# Altium schematic sheet FPGA_Configuration.SchDoc: Configuration Logic
size B; Organization: UCLA High Energy Physics; DocumentNumber: 12; Revision: 2.0; SheetNumber: 12; SheetTotal: 23; CurrentDate: 9/6/2018; ModifiedDate: 9/6/2018
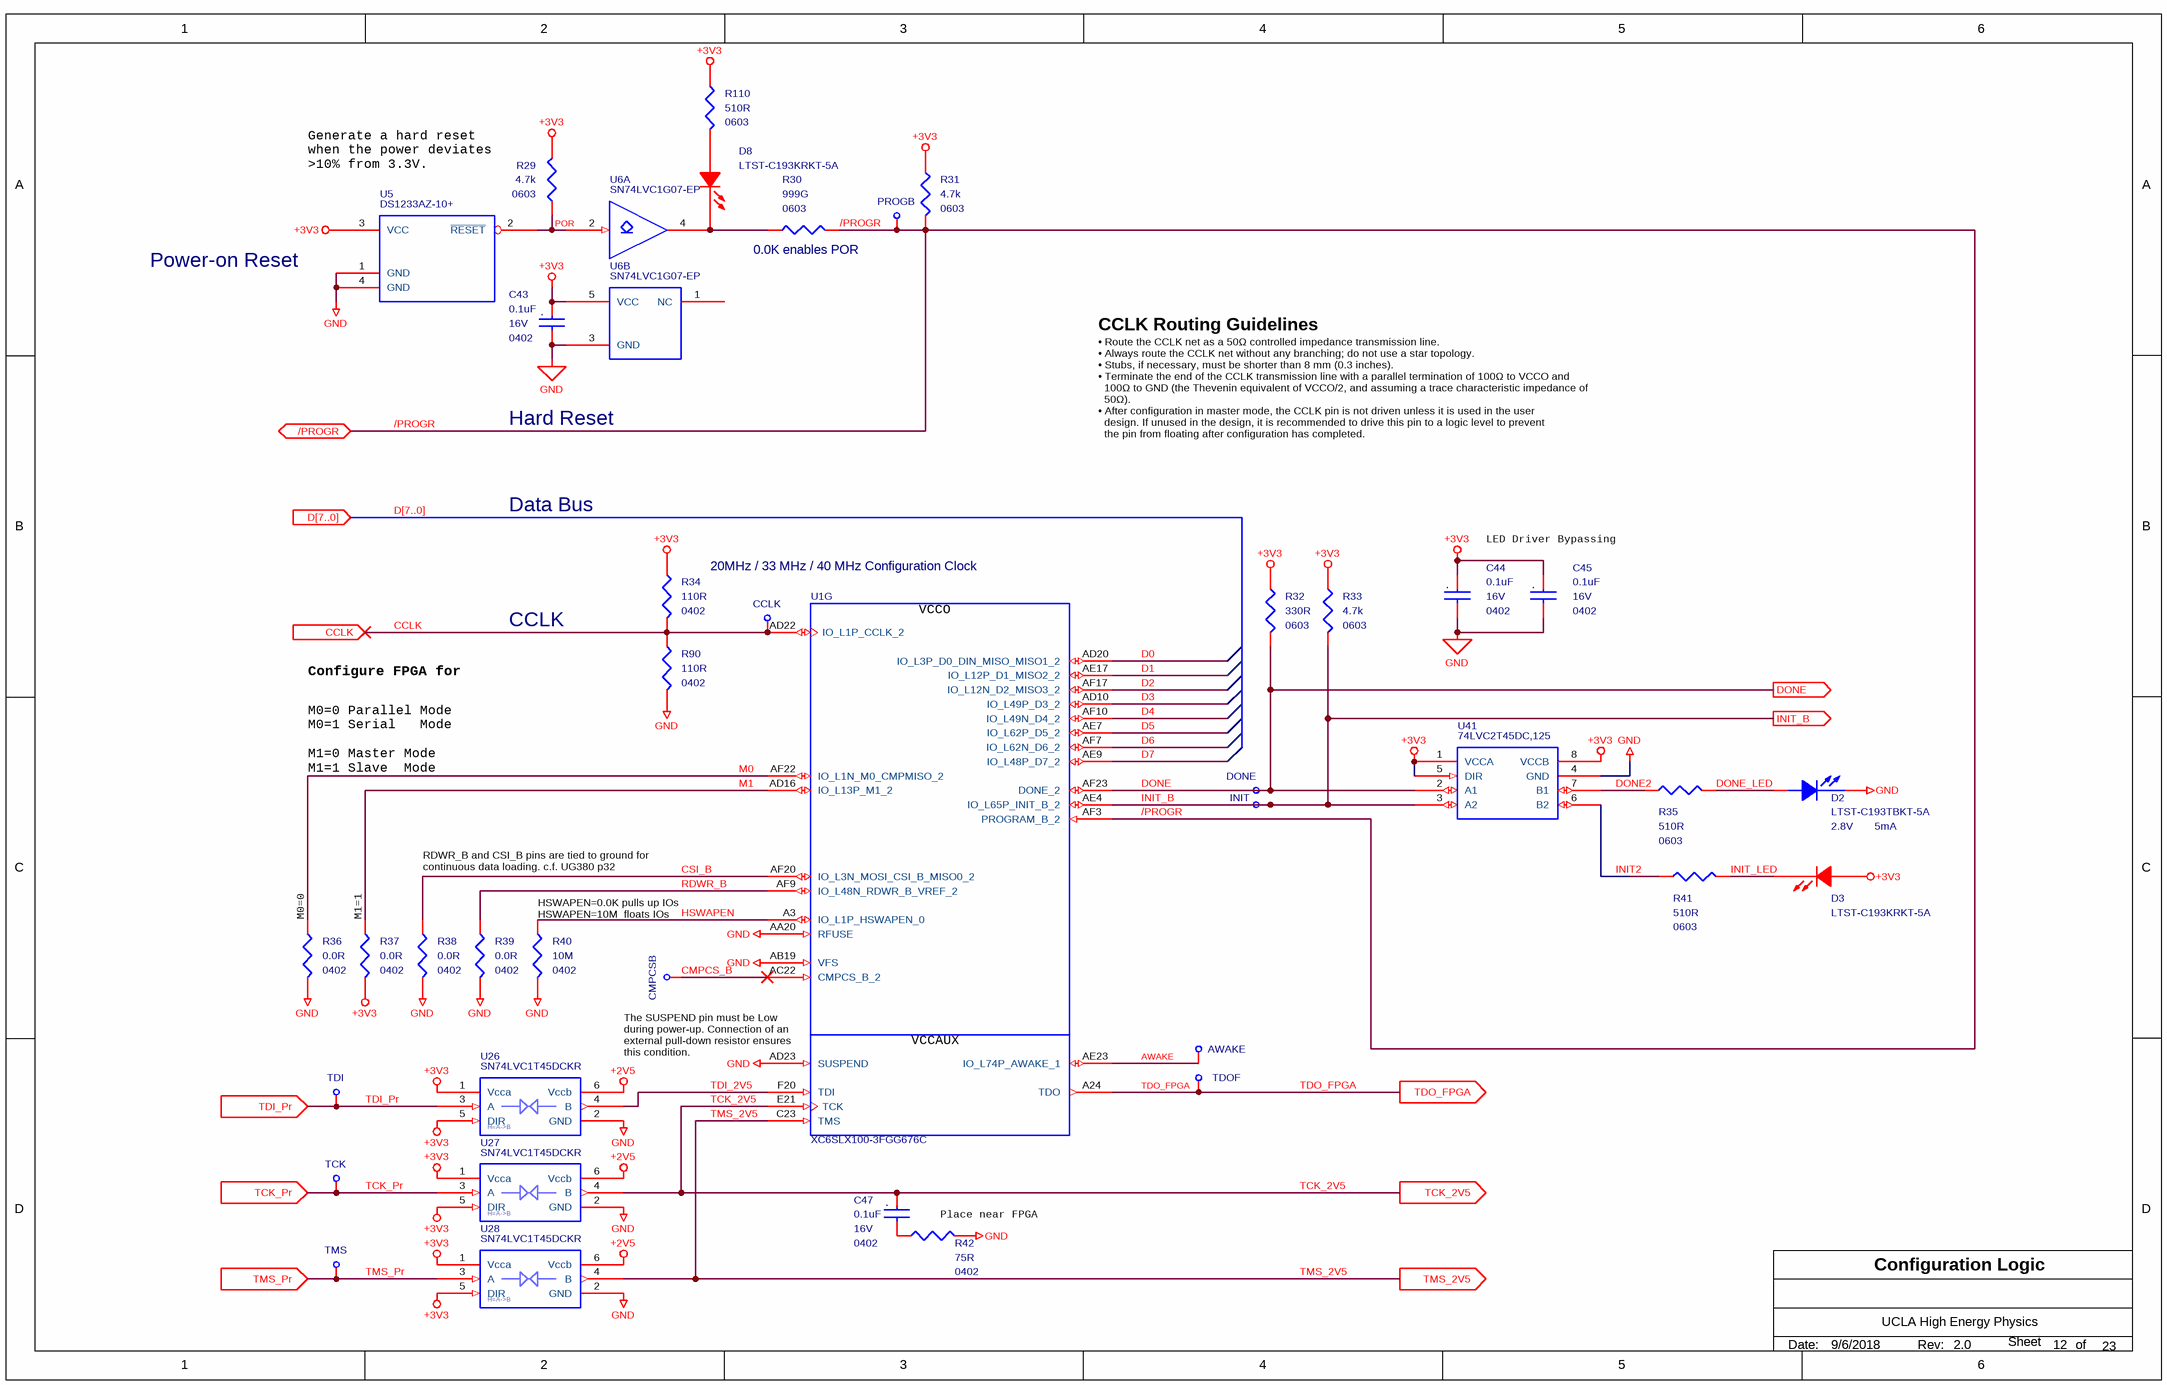
[diagram p0: FPGA_Configuration.SchDoc]

## Parts
AWAKE  Test Point Via  [MC_S6/TH/TPVIA]  (value not drawn)  (no BOM)
C43  0.1uF  package: 0402  Voltage - Rated: 16V  [MC_S6/SM/C_0402_IPC]
C44  0.1uF  package: 0402  Voltage - Rated: 16V  [MC_S6/SM/C_0402_IPC]
C45  0.1uF  package: 0402  Voltage - Rated: 16V  [MC_S6/SM/C_0402_IPC]
C47  0.1uF  package: 0402  Voltage - Rated: 16V  [MC_S6/SM/C_0402_IPC]
CCLK  Test Point Via  [MC_S6/TH/TPVIA]  (value not drawn)  (no BOM)
CMPCSB  Test Point Via  [MC_S6/TH/TPVIA]  (value not drawn)  (no BOM)
D2  LTST-C193TBKT-5A  Voltage - Forward (Vf) (Typ): 2.8V  Current - Test: 5mA  [MC_S6/SM/LED_0603]
D3  LTST-C193KRKT-5A  [MC_S6/SM/LED_0603]
D8  LTST-C193KRKT-5A  [MC_S6/SM/LED_0603]
DONE  Test Point Via  [MC_S6/TH/TPVIA]  (value not drawn)  (no BOM)
INIT  Test Point Via  [MC_S6/TH/TPVIA]  (value not drawn)  (no BOM)
PROGB  Test Point Via  [MC_S6/TH/TPVIA]  (value not drawn)  (no BOM)
R29  4.7k  Supplier Device Package: 0603  [MC_S6/SM/R_0603_IPC]
R30  999G  Supplier Device Package: 0603  [MC_S6/SM/R_0603_IPC]  (no BOM)
R31  4.7k  Supplier Device Package: 0603  [MC_S6/SM/R_0603_IPC]
R32  330R  Supplier Device Package: 0603  [MC_S6/SM/R_0603_IPC]
R33  4.7k  Supplier Device Package: 0603  [MC_S6/SM/R_0603_IPC]
R34  110R  Supplier Device Package: 0402  [MC_S6/SM/R_0402_IPC]
R35  510R  Supplier Device Package: 0603  [MC_S6/SM/R_0603_IPC]
R36  0.0R  Supplier Device Package: 0402  [MC_S6/SM/R_0402_IPC]
R37  0.0R  Supplier Device Package: 0402  [MC_S6/SM/R_0402_IPC]
R38  0.0R  Supplier Device Package: 0402  [MC_S6/SM/R_0402_IPC]
R39  0.0R  Supplier Device Package: 0402  [MC_S6/SM/R_0402_IPC]
R40  10M  Supplier Device Package: 0402  [MC_S6/SM/R_0402_IPC]
R41  510R  Supplier Device Package: 0603  [MC_S6/SM/R_0603_IPC]
R42  75R  Supplier Device Package: 0402  [MC_S6/SM/R_0402_IPC]
R90  110R  Supplier Device Package: 0402  [MC_S6/SM/R_0402_IPC]
R110  510R  Supplier Device Package: 0603  [MC_S6/SM/R_0603_IPC]
TCK  Test Point Via  [MC_S6/TH/TPVIA]  (value not drawn)  (no BOM)
TDI  Test Point Via  [MC_S6/TH/TPVIA]  (value not drawn)  (no BOM)
TDOF  Test Point Via  [MC_S6/TH/TPVIA]  (value not drawn)  (no BOM)
TMS  Test Point Via  [MC_S6/TH/TPVIA]  (value not drawn)  (no BOM)
U1  XC6SLX100-3FGG676C  [FGG676]  (part G of 10)
U5  DS1233AZ-10+  [MC_S6/SM/SOT223_1243]
U6  SN74LVC1G07-EP  [SOT353-1]  (parts A,B of 2)
U26  SN74LVC1T45DCKR  [MC_S6/SM/SOT_SC70_DCK6]
U27  SN74LVC1T45DCKR  [MC_S6/SM/SOT_SC70_DCK6]
U28  SN74LVC1T45DCKR  [MC_S6/SM/SOT_SC70_DCK6]
U41  74LVC2T45DC,125  [VSSOP8 SOT765-1]

## Ports
/PROGR (bidir), CCLK (in), D[7..0] (in), DONE (out), INIT_B (out), TCK_2V5 (out), TCK_Pr (in), TDI_Pr (in), TDO_FPGA (out), TMS_2V5 (out), TMS_Pr (in)

## Nets
+2V5: U26.6(Vccb) U27.6(Vccb) U28.6(Vccb)
+3V3: C43.1 C44.1 C45.1 D3.A(ANODE) R29.1 R31.1 R32.1 R33.1 R34.1 R37.2 R110.1 U5.3(VCC) U6.5(VCC) U26.1(Vcca) U26.5(DIR) U27.1(Vcca) U27.5(DIR) U28.1(Vcca) U28.5(DIR) U41.1(VCCA) U41.5(DIR) U41.8(VCCB)
GND: C43.2 C44.2 C45.2 D2.K(CATHODE) R36.2 R38.2 R39.2 R40.2 R42.2 R90.2 U1.AA20(RFUSE) U1.AB19(VFS) U1.AD23(SUSPEND) U5.1(GND) U5.4(GND) U6.3(GND) U26.2(GND) U27.2(GND) U28.2(GND) U41.4(GND)
/PROGR: PROGB.1(In) R30.2 R31.2 U1.AF3(PROGRAM_B_2) ; port /PROGR
AWAKE: AWAKE.1(In) U1.AE23(IO_L74P_AWAKE_1)
CCLK: CCLK.1(In) R34.2 R90.1 U1.AD22(IO_L1P_CCLK_2) ; port CCLK
CMPCS_B: CMPCSB.1(In) U1.AC22(CMPCS_B_2)
CSI_B: R38.1 U1.AF20(IO_L3N_MOSI_CSI_B_MISO0_2)
D0: U1.AD20(IO_L3P_D0_DIN_MISO_MISO1_2)
D1: U1.AE17(IO_L12P_D1_MISO2_2)
D2: U1.AF17(IO_L12N_D2_MISO3_2)
D3: U1.AD10(IO_L49P_D3_2)
D4: U1.AF10(IO_L49N_D4_2)
D5: U1.AE7(IO_L62P_D5_2)
D6: U1.AF7(IO_L62N_D6_2)
D7: U1.AE9(IO_L48P_D7_2)
DONE: DONE.1(In) R32.2 U1.AF23(DONE_2) U41.2(A1) ; port DONE
DONE2: R35.1 U41.7(B1)
DONE_LED: D2.A(ANODE) R35.2
HSWAPEN: R40.1 U1.A3(IO_L1P_HSWAPEN_0)
INIT2: R41.1 U41.6(B2)
INIT_B: INIT.1(In) R33.2 U1.AE4(IO_L65P_INIT_B_2) U41.3(A2) ; port INIT_B
INIT_LED: D3.K(CATHODE) R41.2
M0: R36.1 U1.AF22(IO_L1N_M0_CMPMISO_2)
M1: R37.1 U1.AD16(IO_L13P_M1_2)
POR: R29.2 U5.2(~{RESET}) U6.2(A)
RDWR_B: R39.1 U1.AF9(IO_L48N_RDWR_B_VREF_2)
TCK_2V5: C47.1 U1.E21(TCK) U27.4(B) ; port TCK_2V5
TCK_Pr: TCK.1(In) U27.3(A) ; port TCK_Pr
TDI_2V5: U1.F20(TDI) U26.4(B)
TDI_Pr: TDI.1(In) U26.3(A) ; port TDI_Pr
TDO_FPGA: TDOF.1(In) U1.A24(TDO) ; port TDO_FPGA
TMS_2V5: U1.C23(TMS) U28.4(B) ; port TMS_2V5
TMS_Pr: TMS.1(In) U28.3(A) ; port TMS_Pr
NetC47_2: C47.2 R42.1
NetD8_A: D8.A(ANODE) R110.2
NetD8_K: D8.K(CATHODE) R30.1 U6.4(Y)

Not connected (* = marked no-connect by the designer): U6 1(NC)

## Buses and harness runs
bus D[7..0] = port D[7..0]

## Notes on the sheet
- Generate a hard reset when the power deviates >10% from 3.3V.
- (near R30) 0.0K enables POR
- Power-on Reset
- CCLK Routing Guidelines
- Hard Reset
- • Route the CCLK net as a 50Ω controlled impedance transmission line.
  • Always route the CCLK net without any branching; do not use a star topology.
  • Stubs, if necessary, must be shorter than 8 mm (0.3 inches).
  • Terminate the end of the CCLK transmission line with a parallel termination of 100Ω to VCCO and
  100Ω to GND (the Thevenin equivalent of VCCO/2, and assuming a trace characteristic impedance of
  50Ω).
  • After configuration in master mode, the CCLK pin is not driven unless it is used in the user
  design. If unused in the design, it is recommended to drive this pin to a logic level to prevent
  the pin from floating after configuration has completed.
- Data Bus
- LED Driver Bypassing
- 20MHz / 33 MHz / 40 MHz Configuration Clock
- Configure FPGA for Parallel Slave SelectMap
- CCLK
- M0=0 Parallel Mode
  M0=1 Serial   Mode
  M1=0 Master Mode
  M1=1 Slave  Mode
- RDWR_B and CSI_B pins are tied to ground for continuous data loading. c.f. UG380 p32
- (near R36) M0=0
- (near R37) M1=1
- (near R40) HSWAPEN=0.0K pulls up IOs
  HSWAPEN=10M  floats IOs
- (near U1) The SUSPEND pin must be Low during power-up. Connection of an external pull-down resistor ensures this condition.
- (near R42) Place near FPGA
- Date:
- Rev:
- of
- Sheet
- (in symbol C0402C104K4RACTU) .
- (in symbol SN74LVC1T45-EP-ALCT_1) H=A->B
- (in symbol XC6SLX100-3FGG676C, part G) VCCO

## Library data of the parts
AWAKE CCLK CMPCSB DONE INIT PROGB TCK TDI TDOF TMS = TPVIA: COMPSIDE: TOP; COMPGROUP: 0; mfgr: Layout; COMPROT: 0; Package: 90; mfgr_id: TPVIA; mfgr_foot: TPVIA
C43-C45 C47 = C0402C104K4RACTU: CAP CER 0.1UF 16V X7R 0402; Manufacturer: KEMET; Capacitance: 0.10µF; Tolerance: ±10%; Supplier 1: Digi-Key; Manufacturer Part Number: C0402C104K4RACTU; RoHS: RoHS Compliant; Category: Capacitors; Stock 1: 3565698; Pricing 1: 1=0.11, 10=0.078, 25=0.0568, 50=0.0442, 100=0.0365, 250=0.03024, 500=0.02562, 1000=0.02121, 5000=0.01806 (USD); Packaging: Cut Tape (CT); Part Status: Active; Operating Temperature: -55°C ~ 125°C; Features: -; Ratings: -; Applications: General Purpose; Failure Rate: -; Mounting Type: Surface Mount, MLCC; Package / Case: 0402 (1005 Metric); Size / Dimension: 0.039" L x 0.020" W (1.00mm x 0.50mm); Height - Seated (Max): -; Thickness (Max): 0.022" (0.55mm); Lead Spacing: -; Lead Style: -; ComponentLink1URL: http://www.kemet.com/docfinder?Partnumber=C0402C104K4RACTU; ComponentLink1Description: http://www.kemet.com/docfinder?Partnumber=C0402C104K4RACTU; Supplier 2: Digi-Key; Stock 2: 3565998; Pricing 2: 1=0.11, 10=0.078, 25=0.0568, 50=0.0442, 100=0.0365, 250=0.03024, 500=0.02562, 1000=0.02121, 5000=0.01806 (USD); Supplier Part Number 1: 399-3521-1-ND; Supplier Part Number 2: 399-3521-6-ND; Temperature Coefficient: X7R
D2 = LTST-C193TBKT-5A: LED BLUE CLEAR 0603 SMD; Manufacturer: Lite-On Inc.; Lens Color: Colorless; Millicandela Rating: 15mcd; Lens Style/Size: Rectangle with Flat Top, 1.15mm x 0.80mm; Viewing Angle: 130°; Wavelength - Dominant: 470nm; Wavelength - Peak: 468nm; Supplier 1: Digi-Key; Manufacturer Part Number: LTST-C193TBKT-5A; RoHS: RoHS Compliant; Category: Optoelectronics; Stock 1: 380419; Pricing 1: 1=0.47, 10=0.336, 25=0.2572, 100=0.1678, 250=0.12304, 500=0.10442, 1000=0.08577 (USD); Packaging: Cut Tape (CT); Part Status: Active; Color: Blue; Lens Transparency: Clear; Mounting Type: Surface Mount; Features: -; Package / Case: 0603 (1608 Metric); Size / Dimension: 1.60mm L x 0.80mm W; Height (Max): 0.35mm; ComponentLink1URL: http://optoelectronics.liteon.com/upload/download/DS22-2004-060/P_100_LTST-C193TBKT-5A.pdf; ComponentLink1Description: http://optoelectronics.liteon.com/upload/download/DS22-2004-060/P_100_LTST-C193TBKT-5A.pdf; Supplier 2: Digi-Key; Stock 2: 380419; Pricing 2: 1=0.47, 10=0.336, 25=0.2572, 100=0.1678, 250=0.12304, 500=0.10442, 1000=0.08577 (USD); Supplier Part Number 1: 160-1827-1-ND; Supplier Part Number 2: 160-1827-6-ND; ComponentLink2Description: http://media.digikey.com/pdf/Data%20Sheets/Lite-On%20PDFs/LTST-C193TBKT-5A.pdf; ComponentLink2URL: http://media.digikey.com/pdf/Data%20Sheets/Lite-On%20PDFs/LTST-C193TBKT-5A.pdf; Supplier Device Package: Chip LED
D3 = LTST-C193KRKT-5A: LED RED CLEAR 0603 SMD; Manufacturer: Lite-On Inc.; Current - Test: 5mA; Lens Color: Colorless; Lens Style/Size: Rectangle with Flat Top, 1.15mm x 0.80mm; Millicandela Rating: 26.05mcd; Viewing Angle: 130°; Voltage - Forward (Vf) (Typ): 2V; Wavelength - Dominant: 631nm; Wavelength - Peak: 639nm; Category: Optoelectronics; Color: Red; ComponentLink1Description: http://optoelectronics.liteon.com/upload/download/DS22-2005-077/LTST-C193KRKT-5A.PDF; ComponentLink1URL: http://optoelectronics.liteon.com/upload/download/DS22-2005-077/LTST-C193KRKT-5A.PDF; Features: -; Height (Max): 0.45mm; Lens Transparency: Clear; Manufacturer Part Number: LTST-C193KRKT-5A; Mounting Type: Surface Mount; Package / Case: 0603 (1608 Metric); Packaging: Cut Tape (CT); Part Status: Active; Pricing 1: 1=0.41, 10=0.296, 25=0.2268, 100=0.148, 250=0.10852, 500=0.0921, 1000=0.07565, 2500=0.06578 (USD); Pricing 2: 1=0.41, 10=0.296, 25=0.2268, 100=0.148, 250=0.10852, 500=0.0921, 1000=0.07565, 2500=0.06578 (USD); RoHS: RoHS Compliant; Size / Dimension: 1.60mm L x 0.80mm W; Stock 1: 97257; Stock 2: 97257; Supplier 1: Digi-Key; Supplier 2: Digi-Key; Supplier Device Package: Chip LED; Supplier Part Number 1: 160-1830-1-ND; Supplier Part Number 2: 160-1830-6-ND
D8 = LTST-C193KRKT-5A: LED RED CLEAR 0603 SMD; Manufacturer: Lite-On Inc.; Lens Color: Colorless; Millicandela Rating: 26.05mcd; Lens Style/Size: Rectangle with Flat Top, 1.15mm x 0.80mm; Voltage - Forward (Vf) (Typ): 2V; Current - Test: 5mA; Viewing Angle: 130°; Wavelength - Dominant: 631nm; Wavelength - Peak: 639nm; Supplier 1: Digi-Key; Manufacturer Part Number: LTST-C193KRKT-5A; RoHS: RoHS Compliant; Category: Optoelectronics; Stock 1: 97257; Pricing 1: 1=0.41, 10=0.296, 25=0.2268, 100=0.148, 250=0.10852, 500=0.0921, 1000=0.07565, 2500=0.06578 (USD); Packaging: Cut Tape (CT); Part Status: Active; Color: Red; Lens Transparency: Clear; Mounting Type: Surface Mount; Features: -; Package / Case: 0603 (1608 Metric); Supplier Device Package: Chip LED; Size / Dimension: 1.60mm L x 0.80mm W; Height (Max): 0.45mm; ComponentLink1URL: http://optoelectronics.liteon.com/upload/download/DS22-2005-077/LTST-C193KRKT-5A.PDF; ComponentLink1Description: http://optoelectronics.liteon.com/upload/download/DS22-2005-077/LTST-C193KRKT-5A.PDF; Supplier 2: Digi-Key; Stock 2: 97257; Pricing 2: 1=0.41, 10=0.296, 25=0.2268, 100=0.148, 250=0.10852, 500=0.0921, 1000=0.07565, 2500=0.06578 (USD); Supplier Part Number 1: 160-1830-1-ND; Supplier Part Number 2: 160-1830-6-ND
R29 R31 R33 = CR0603-FX-4701ELF: RES SMD 4.7K OHM 1% 1/10W 0603; Manufacturer: Bourns Inc.; Power (Watts): 0.1W, 1/10W; Temperature Coefficient: ±100ppm/°C; Supplier 1: Digi-Key; Manufacturer Part Number: CR0603-FX-4701ELF; RoHS: RoHS Compliant; Category: Resistors; Stock 1: 43560; Pricing 1: 1=0.1, 10=0.021, 100=0.0086, 1000=0.00385, 2500=0.00334 (USD); Packaging: Cut Tape (CT); Part Status: Active; Resistance (Ohms): 4.7k; Composition: Thick Film; Features: Moisture Resistant; Operating Temperature: -55°C ~ 155°C; Package / Case: 0603 (1608 Metric); Size / Dimension: 0.063" L x 0.031" W (1.60mm x 0.80mm); Height - Seated (Max): 0.022" (0.55mm); Failure Rate: -; ComponentLink1URL: http://www.bourns.com/docs/Product-Datasheets/CHPREZTR.pdf; ComponentLink1Description: http://www.bourns.com/docs/Product-Datasheets/CHPREZTR.pdf; Supplier 2: Digi-Key; Stock 2: 43560; Pricing 2: 1=0.1, 10=0.021, 100=0.0086, 1000=0.00385, 2500=0.00334 (USD); Supplier Part Number 1: CR0603-FX-4701ELFCT-ND; Supplier Part Number 2: CR0603-FX-4701ELFDKR-ND; Tolerance: ±1%
R30 = RES999G 0603: RES SMD 999G OHM 5% 1/10W 0603; Manufacturer Part Number: Do Not Place
R32 = CR0603-FX-3300ELF: RES SMD 330 OHM 1% 1/10W 0603; Manufacturer: Bourns Inc.; Resistance (Ohms): 330; Power (Watts): 0.1W, 1/10W; Temperature Coefficient: ±100ppm/°C; Tolerance: ±1%; Supplier 1: Digi-Key; Manufacturer Part Number: CR0603-FX-3300ELF; RoHS: RoHS Compliant; Category: Resistors; Stock 1: 45245; Pricing 1: 1=0.1, 10=0.023, 100=0.0092, 1000=0.00414, 2500=0.00359 (USD); Packaging: Cut Tape (CT); Part Status: Active; Composition: Thick Film; Features: Moisture Resistant; Operating Temperature: -55°C ~ 155°C; Package / Case: 0603 (1608 Metric); Size / Dimension: 0.063" L x 0.031" W (1.60mm x 0.80mm); Height - Seated (Max): 0.022" (0.55mm); Failure Rate: -; ComponentLink1URL: http://www.bourns.com/docs/Product-Datasheets/CHPREZTR.pdf; ComponentLink1Description: http://www.bourns.com/docs/Product-Datasheets/CHPREZTR.pdf; Supplier 2: Digi-Key; Stock 2: 45245; Pricing 2: 1=0.1, 10=0.023, 100=0.0092, 1000=0.00414, 2500=0.00359 (USD); Supplier Part Number 1: CR0603-FX-3300ELFCT-ND; Supplier Part Number 2: CR0603-FX-3300ELFDKR-ND
R34 R90 = ERJ-2RKF1100X: RES SMD 110 OHM 1% 1/10W 0402; Manufacturer: Panasonic Electronic Components; Power (Watts): 0.1W, 1/10W; Temperature Coefficient: ±100ppm/°C; Supplier 1: Digi-Key; Manufacturer Part Number: ERJ-2RKF1100X; RoHS: RoHS Compliant; Category: Resistors; Stock 1: 171366; Pricing 1: 1=0.1, 10=0.039, 100=0.016, 1000=0.00719, 2500=0.00624, 5000=0.00515 (USD); Packaging: Cut Tape (CT); Part Status: Active; Composition: Thick Film; Features: Automotive AEC-Q200; Operating Temperature: -55°C ~ 155°C; Package / Case: 0402 (1005 Metric); Size / Dimension: 0.039" L x 0.020" W (1.00mm x 0.50mm); Height - Seated (Max): 0.016" (0.40mm); Failure Rate: -; ComponentLink1URL: https://industrial.panasonic.com/cdbs/www-data/pdf/RDA0000/AOA0000C304.pdf; ComponentLink1Description: https://industrial.panasonic.com/cdbs/www-data/pdf/RDA0000/AOA0000C304.pdf; Supplier 2: Digi-Key; Stock 2: 171366; Pricing 2: 1=0.1, 10=0.039, 100=0.016, 1000=0.00719, 2500=0.00624, 5000=0.00515 (USD); Supplier Part Number 1: P110LCT-ND; Supplier Part Number 2: P110LDKR-ND; Tolerance: ±1%
R35 R41 R110 = CR0603-FX-5100ELF: RES SMD 510 OHM 1% 1/10W 0603; Manufacturer: Bourns Inc.; Power (Watts): 0.1W, 1/10W; Temperature Coefficient: ±100ppm/°C; Tolerance: ±1%; Supplier 1: Digi-Key; Manufacturer Part Number: CR0603-FX-5100ELF; RoHS: RoHS Compliant; Category: Resistors; Stock 1: 523; Pricing 1: 1=0.1, 10=0.021, 100=0.0086, 1000=0.00385, 2500=0.00334 (USD); Packaging: Digi-Reel®; Part Status: Active; Composition: Thick Film; Features: Moisture Resistant; Operating Temperature: -55°C ~ 155°C; Package / Case: 0603 (1608 Metric); Size / Dimension: 0.063" L x 0.032" W (1.60mm x 0.80mm); Height - Seated (Max): 0.022" (0.55mm); Failure Rate: -; ComponentLink1URL: https://www.bourns.com/docs/Product-Datasheets/CHPREZTR.pdf; ComponentLink1Description: https://www.bourns.com/docs/Product-Datasheets/CHPREZTR.pdf; Supplier Part Number 1: CR0603-FX-5100ELFDKR-ND
R36-R39 = ERJ-2GE0R00X: RES SMD 0.0OHM JUMPER 1/10W 0402; Manufacturer: Panasonic Electronic Components; Resistance (Ohms): 0.0; Power (Watts): 0.1W, 1/10W; Tolerance: Jumper; Supplier 1: Digi-Key; Manufacturer Part Number: ERJ-2GE0R00X; RoHS: RoHS Compliant; Category: Resistors; Stock 1: 3132025; Pricing 1: 1=0.1, 50=0.0138, 100=0.0105, 250=0.0078, 500=0.00576, 1000=0.00384, 5000=0.0027 (USD); Packaging: Cut Tape (CT); Part Status: Active; Composition: Thick Film; Features: Automotive AEC-Q200; Temperature Coefficient: -; Operating Temperature: -55°C ~ 155°C; Package / Case: 0402 (1005 Metric); Size / Dimension: 0.039" L x 0.020" W (1.00mm x 0.50mm); Height - Seated (Max): 0.016" (0.40mm); Failure Rate: -; ComponentLink1URL: http://industrial.panasonic.com/www-cgi/jvcr13pz.cgi?E+PZ+3+AOA0001+ERJ2GE0R00X+7+WW; ComponentLink1Description: http://industrial.panasonic.com/www-cgi/jvcr13pz.cgi?E+PZ+3+AOA0001+ERJ2GE0R00X+7+WW; Supplier 2: Digi-Key; Stock 2: 3132025; Pricing 2: 1=0.1, 50=0.0138, 100=0.0105, 250=0.0078, 500=0.00576, 1000=0.00384, 5000=0.0027 (USD); Supplier Part Number 1: P0.0JCT-ND; Supplier Part Number 2: P0.0JDKR-ND; Number of Terminations: 2
R40 = ERJ-2GEJ106X: RES SMD 10M OHM 5% 1/10W 0402; Manufacturer: Panasonic Electronic Components; Power (Watts): 0.1W, 1/10W; Temperature Coefficient: -400/ +150ppm/°C; Tolerance: ±5%; Supplier 1: Digi-Key; Manufacturer Part Number: ERJ-2GEJ106X; RoHS: RoHS Compliant; Category: Resistors; Stock 1: 53777; Pricing 1: 1=0.1, 50=0.0106, 100=0.0078, 250=0.00596, 500=0.00476, 1000=0.0035, 5000=0.00251 (USD); Packaging: Cut Tape (CT); Part Status: Active; Resistance (Ohms): 10M; Composition: Thick Film; Features: Automotive AEC-Q200; Operating Temperature: -55°C ~ 155°C; Package / Case: 0402 (1005 Metric); Size / Dimension: 0.039" L x 0.020" W (1.00mm x 0.50mm); Height - Seated (Max): 0.016" (0.40mm); Number of Terminations: 2; Failure Rate: -; ComponentLink1URL: http://industrial.panasonic.com/www-cgi/jvcr13pz.cgi?E+PZ+3+AOA0001+ERJ2GEJ106X+7+WW; ComponentLink1Description: http://industrial.panasonic.com/www-cgi/jvcr13pz.cgi?E+PZ+3+AOA0001+ERJ2GEJ106X+7+WW; Supplier 2: Digi-Key; Stock 2: 53777; Pricing 2: 1=0.1, 50=0.0106, 100=0.0078, 250=0.00596, 500=0.00476, 1000=0.0035, 5000=0.00251 (USD); Supplier Part Number 1: P10MJCT-ND; Supplier Part Number 2: P10MJDKR-ND
R42 = ERJ-2GEJ750X: RES SMD 75 OHM 5% 1/10W 0402; Manufacturer: Panasonic Electronic Components; Power (Watts): 0.1W, 1/10W; Temperature Coefficient: ±200ppm/°C; Tolerance: ±5%; Supplier 1: Digi-Key; Manufacturer Part Number: ERJ-2GEJ750X; RoHS: RoHS Compliant; Category: Resistors; Stock 1: 127750; Pricing 1: 1=0.1, 10=0.02, 100=0.008, 1000=0.00359, 2500=0.00312, 5000=0.00258 (USD); Packaging: Cut Tape (CT); Part Status: Active; Composition: Thick Film; Features: Automotive AEC-Q200; Operating Temperature: -55°C ~ 155°C; Package / Case: 0402 (1005 Metric); Size / Dimension: 0.039" L x 0.020" W (1.00mm x 0.50mm); Height - Seated (Max): 0.016" (0.40mm); Failure Rate: -; ComponentLink1URL: http://industrial.panasonic.com/www-cgi/jvcr13pz.cgi?E+PZ+3+AOA0001+ERJ2GEJ750X+7+WW; ComponentLink1Description: http://industrial.panasonic.com/www-cgi/jvcr13pz.cgi?E+PZ+3+AOA0001+ERJ2GEJ750X+7+WW; Supplier 2: Digi-Key; Stock 2: 127750; Pricing 2: 1=0.1, 10=0.02, 100=0.008, 1000=0.00359, 2500=0.00312, 5000=0.00258 (USD); Supplier Part Number 1: P75JCT-ND; Supplier Part Number 2: P75JDKR-ND
U1 = XC6SLX100-3FGG676C: Manufacturer: Xilinx Inc.; Voltage - Supply: 1.14 V ~ 1.26 V; Supplier 1: Digi-Key; Manufacturer Part Number: XC6SLX100-3FGG676C; RoHS: RoHS Compliant; Category: Integrated Circuits (ICs); Stock 1: 275; Pricing 1: 1=145.6 (USD); Part Status: Active; Mounting Type: Surface Mount; Operating Temperature: 0°C ~ 85°C (TJ); Package / Case: 676-BGA; Supplier Device Package: 676-FBGA (27x27); ComponentLink1URL: http://www.xilinx.com/support/documentation/data_sheets/ds162.pdf; ComponentLink1Description: http://www.xilinx.com/support/documentation/data_sheets/ds162.pdf; Supplier Part Number 1: 122-1760-ND
U5 = DS1233AZ-10+: IC POR 2.88V 10% SOT223; Manufacturer: Maxim Integrated; Manufacturer Part Number: DS1233AZ-10+T&R; Output: Open Drain or Open Collector; Reset: Active Low; Reset Timeout: 250 ms Minimum; Supplier 1: Digi-Key; RoHS: RoHS Compliant; Category: Integrated Circuits (ICs); Stock 1: 3429; Pricing 1: 1=2.14, 10=2.015, 25=1.6116, 50=1.531, 100=1.4102, 250=1.33764, 500=1.28928 (USD); Packaging: Cut Tape (CT); Part Status: Active; Type: Simple Reset/Power-On Reset; Voltage - Threshold: 2.88V; Operating Temperature: -40°C ~ 85°C (TA); Mounting Type: Surface Mount; Package / Case: TO-261-4, TO-261AA; Supplier Device Package: SOT-223-3; ComponentLink1URL: http://datasheets.maximintegrated.com/en/ds/DS1233A.pdf; ComponentLink1Description: http://datasheets.maximintegrated.com/en/ds/DS1233A.pdf; Supplier 2: Digi-Key; Stock 2: 2849; Pricing 2: 1=2.55, 10=2.423, 25=1.7, 50=1.615, 100=1.26, 250=1.197 (USD); Supplier 3: Digi-Key; Stock 3: 3429; Pricing 3: 1=2.14, 10=2.015, 25=1.6116, 50=1.531, 100=1.4102, 250=1.33764, 500=1.28928 (USD); Supplier Part Number 1: DS1233AZ-10+CT-ND; Supplier Part Number 2: DS1233AZ-10+-ND; Supplier Part Number 3: DS1233AZ-10+DKR-ND
U6 = SN74LVC1G07-EP: IC BUFF/DVR NON-INVERT Open Drain SC70-5; Manufacturer: Texas Instruments; mfgr_id: SN74LVC1G07MDCKREP; mfgr: Texas Inst; mfgr_foot: DCK; COMPROT: 270; COMPGROUP: 0; COMPSIDE: TOP; Logic Type: Buffer, Non-Inverting; Number of Bits per Element: 1; Current - Output High, Low: -, 32mA; Voltage - Supply: 1.65 V ~ 5.5 V; Package: 99; Supplier 1: Digi-Key; Manufacturer Part Number: SN74LVC1G07MDCKREP; RoHS: RoHS Compliant; Category: Integrated Circuits (ICs); Stock 1: 4252; Pricing 1: 1=0.81, 10=0.714, 100=0.5472, 500=0.4326, 1000=0.34608 (USD); Packaging: Cut Tape (CT); Part Status: Active; Input Type: -; Output Type: Open Drain; Operating Temperature: -55°C ~ 125°C (TA); Mounting Type: Surface Mount; Package / Case: 5-TSSOP, SC-70-5, SOT-353; Supplier Device Package: SC-70-5; ComponentLink1URL: http://www.ti.com/lit/ds/symlink/sn74lvc1g07-ep.pdf; ComponentLink1Description: http://www.ti.com/lit/ds/symlink/sn74lvc1g07-ep.pdf; Supplier 2: Digi-Key; Stock 2: 4252; Pricing 2: 1=0.81, 10=0.714, 100=0.5472, 500=0.4326, 1000=0.34608 (USD); Supplier Part Number 1: 296-22343-1-ND; Supplier Part Number 2: 296-22343-6-ND
U26-U28 = SN74LVC1T45-EP-ALCT_1: IC BUS TRANSCVR TRI-ST SC70-6; Manufacturer: Texas Instruments; COMPSIDE: TOP; COMPGROUP: 0; COMPROT: 270; mfgr_id: SN74LVC1T45MDCKREP; mfgr: Texas Inst; mfgr_foot: DCK; Translator Type: Voltage Level; Channel Type: Bidirectional; Channels per Circuit: 1; Output Type: Tri-State, Non-Inverted; Data Rate: 420Mbps; Supplier 1: Digi-Key; Manufacturer Part Number: SN74LVC1T45DCKR; RoHS: RoHS Compliant; Category: Integrated Circuits (ICs); Stock 1: 91787; Pricing 1: 1=0.58, 10=0.494, 100=0.3692, 500=0.29004, 1000=0.22413 (USD); Packaging: Cut Tape (CT); Part Status: Active; Input Signal: -; Output Signal: -; Operating Temperature: -40°C ~ 85°C (TA); Features: -; Mounting Type: Surface Mount; Package / Case: 6-TSSOP, SC-88, SOT-363; Supplier Device Package: SC-70-6; ComponentLink1URL: http://www.ti.com/lit/ds/symlink/sn74lvc1t45.pdf; ComponentLink1Description: http://www.ti.com/lit/ds/symlink/sn74lvc1t45.pdf; Supplier 2: Digi-Key; Stock 2: 91787; Pricing 2: 1=0.58, 10=0.494, 100=0.3692, 500=0.29004, 1000=0.22413 (USD); Supplier Part Number 1: 296-16844-1-ND; Supplier Part Number 2: 296-16844-6-ND
U41 = 74LVC2T45DC,125: IC TRNSLTR BIDIRECTIONAL 8VSSOP; Manufacturer: Nexperia USA Inc.; Translator Type: Voltage Level; Channels per Circuit: 2; Output Type: Tri-State, Non-Inverted; Data Rate: 420Mbps; Propagation Delay: 48.6ns; Min Supply Voltage: 1.2V; Max Supply Voltage: 5.5V; Max Power Dissipation: 250mW; Number of Elements: 1; Logic Function: Transceiver,Translator; Turn-On Delay Time: 15.2ns; High Level Output Current: -32mA; Low Level Output Current: 32mA; Quiescent Current: 8uA; Polarity: Non-Inverting; Supplier 1: Digi-Key; Manufacturer Part Number: 74LVC2T45DC,125; RoHS: RoHS Compliant; Category: Integrated Circuits (ICs); Stock 1: 0; Pricing 1: 1=0.58, 10=0.51, 100=0.3909, 500=0.309, 1000=0.2472 (USD); Packaging: Digi-Reel®; Part Status: Active; Channel Type: Bidirectional; Input Signal: -; Output Signal: -; Operating Temperature: -40°C ~ 125°C (TA); Features: -; Mounting Type: Surface Mount; Package / Case: 8-VFSOP (0.091", 2.30mm Width); Supplier Device Package: 8-VSSOP; Base Part Number: 74LVC2T45; ComponentLink1URL: https://assets.nexperia.com/documents/data-sheet/74LVC_LVCH2T45.pdf; ComponentLink1Description: https://assets.nexperia.com/documents/data-sheet/74LVC_LVCH2T45.pdf; Supplier Part Number 1: 1727-4578-6-ND; Mount: Surface Mount; Case/Package: VSSOP; Number of Pins: 8; Contact Plating: Gold; Min Operating Temperature: -40°C; Max Operating Temperature: 125°C; Number of Channels: 2; Package Quantity: 3000; Direction: Bidirectional; Number of Bits: 2; Radiation Hardening: No; REACH SVHC: No SVHC; Lead Free: Lead Free; ComponentLink2URL: https://datasheet.ciiva.com/1900/74lvc-lvch2t45-1900049.pdf; ComponentLink2Description: https://datasheet.ciiva.com/1900/74lvc-lvch2t45-1900049.pdf; ComponentLink3URL: https://datasheet.ciiva.com/1900/74lvc-lvch2t45-1900050.pdf; ComponentLink3Description: https://datasheet.ciiva.com/1900/74lvc-lvch2t45-1900050.pdf; ComponentLink4URL: https://datasheet.ciiva.com/1900/74lvc-lvch2t45-1900051.pdf; ComponentLink4Description: https://datasheet.ciiva.com/1900/74lvc-lvch2t45-1900051.pdf; ComponentLink5URL: https://datasheet.ciiva.com/16406/74lvc-lvch2t45-16406598.pdf; ComponentLink5Description: https://datasheet.ciiva.com/16406/74lvc-lvch2t45-16406598.pdf; ComponentLink6URL: https://datasheet.ciiva.com/4798/74lvc-lvch2t45-4798887.pdf; ComponentLink6Description: https://datasheet.ciiva.com/4798/74lvc-lvch2t45-4798887.pdf; ComponentLink7URL: https://datasheet.ciiva.com/16591/74lvc-lvch2t45-16591338.pdf; ComponentLink7Description: https://datasheet.ciiva.com/16591/74lvc-lvch2t45-16591338.pdf; ComponentLink8URL: https://datasheet.ciiva.com/15086/getdatasheetpartid-422533-15086781.pdf; ComponentLink8Description: https://datasheet.ciiva.com/15086/getdatasheetpartid-422533-15086781.pdf